# Altium schematic sheet AnalogADCs.SchDoc: ADC
size Letter; Engineer: Nathan Petersen; DocumentNumber: 12; Revision: v1.2; SheetNumber: 12; SheetTotal: 26
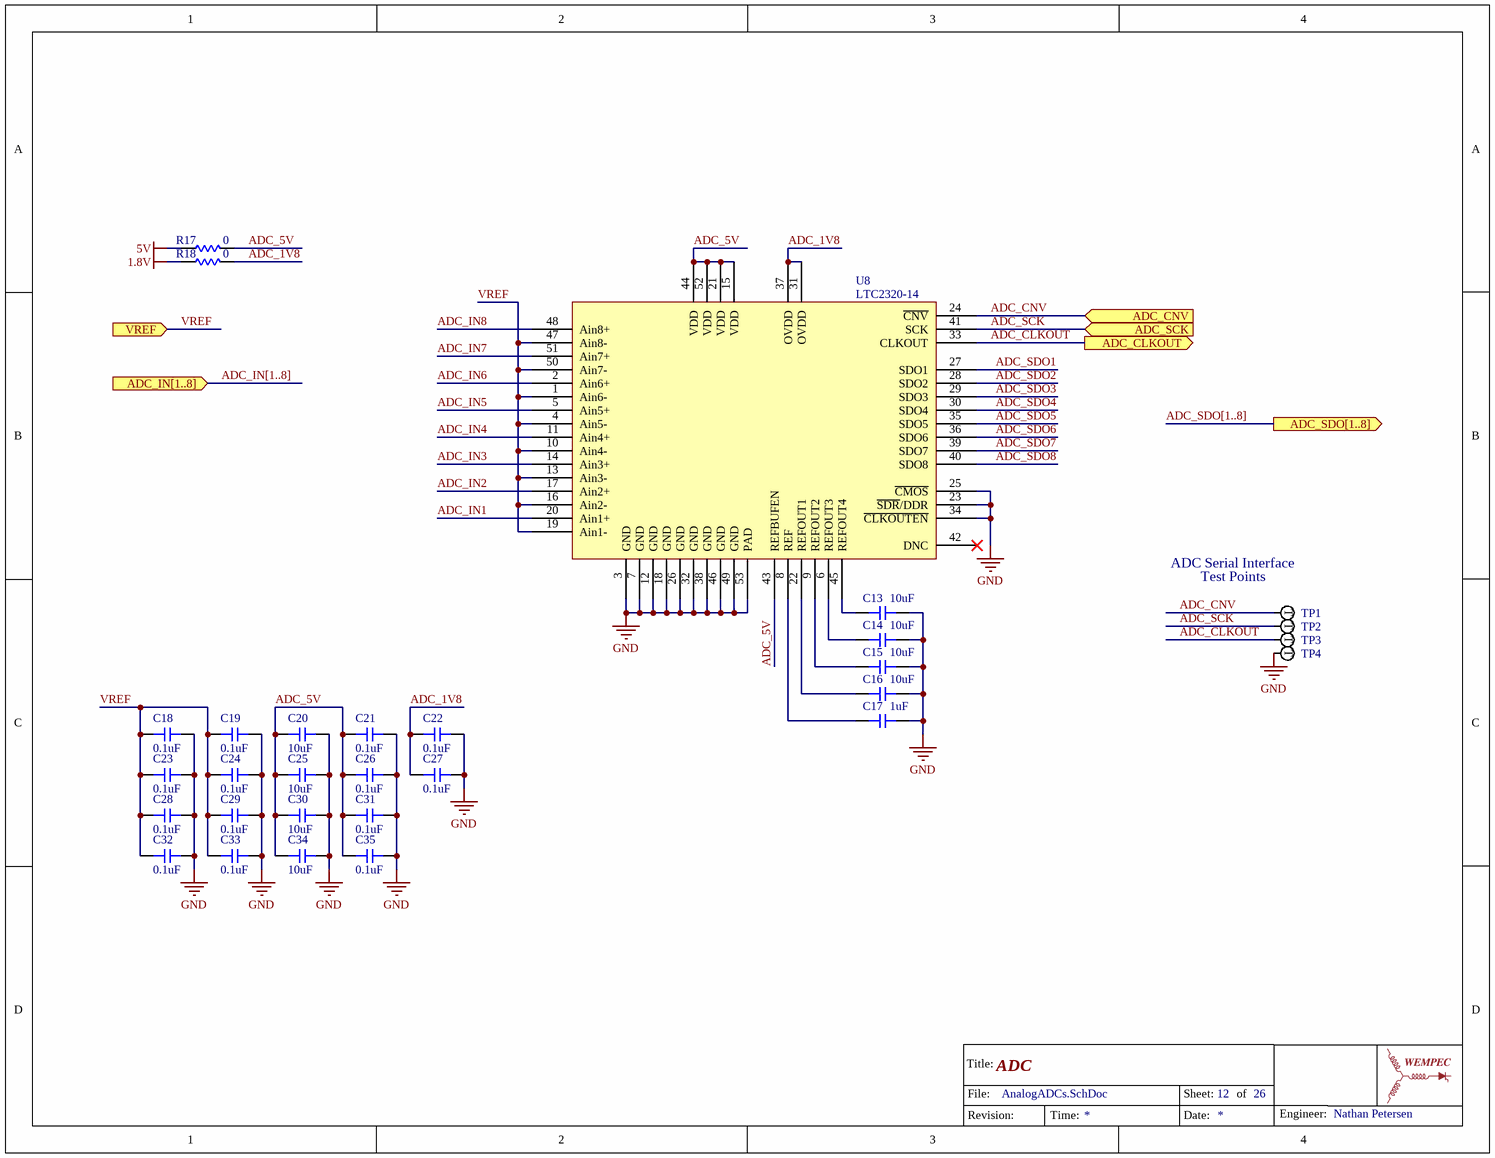
[diagram p0: AnalogADCs.SchDoc]

## Parts
C13  value 10uF  [0603-CAP]  (hidden comment: Capacitor)
C14  value 10uF  [0603-CAP]  (hidden comment: Capacitor)
C15  value 10uF  [0603-CAP]  (hidden comment: Capacitor)
C16  value 10uF  [0603-CAP]  (hidden comment: Capacitor)
C17  value 1uF  [0603-CAP]  (hidden comment: Capacitor)
C18  value 0.1uF  [0603-CAP]  (hidden comment: Capacitor)
C19  value 0.1uF  [0603-CAP]  (hidden comment: Capacitor)
C20  value 10uF  [0603-CAP]  (hidden comment: Capacitor)
C21  value 0.1uF  [0603-CAP]  (hidden comment: Capacitor)
C22  value 0.1uF  [0603-CAP]  (hidden comment: Capacitor)
C23  value 0.1uF  [0603-CAP]  (hidden comment: Capacitor)
C24  value 0.1uF  [0603-CAP]  (hidden comment: Capacitor)
C25  value 10uF  [0603-CAP]  (hidden comment: Capacitor)
C26  value 0.1uF  [0603-CAP]  (hidden comment: Capacitor)
C27  value 0.1uF  [0603-CAP]  (hidden comment: Capacitor)
C28  value 0.1uF  [0603-CAP]  (hidden comment: Capacitor)
C29  value 0.1uF  [0603-CAP]  (hidden comment: Capacitor)
C30  value 10uF  [0603-CAP]  (hidden comment: Capacitor)
C31  value 0.1uF  [0603-CAP]  (hidden comment: Capacitor)
C32  value 0.1uF  [0603-CAP]  (hidden comment: Capacitor)
C33  value 0.1uF  [0603-CAP]  (hidden comment: Capacitor)
C34  value 10uF  [0603-CAP]  (hidden comment: Capacitor)
C35  value 0.1uF  [0603-CAP]  (hidden comment: Capacitor)
R17  value 0  [1206-RES]  (hidden comment: Resistor)
R18  value 0  [1206-RES]  (hidden comment: Resistor)
TP1  Test Point  [RCU-0C]  (value not drawn)
TP2  Test Point  [RCU-0C]  (value not drawn)
TP3  Test Point  [RCU-0C]  (value not drawn)
TP4  Test Point  [RCU-0C]  (value not drawn)
U8  LTC2320-14  [QFN50P700X800X80_HS-53N]

## Ports
ADC_CLKOUT (out), ADC_CNV (in), ADC_IN[1..8] (in), ADC_SCK (in), ADC_SDO[1..8] (out), VREF (in)

## Nets
1.8V: R18.1
5V: R17.1
GND: C13.2 C14.2 C15.2 C16.2 C17.2 C18.2 C19.2 C20.2 C21.2 C22.2 C23.2 C24.2 C25.2 C26.2 C27.2 C28.2 C29.2 C30.2 C31.2 C32.2 C33.2 C34.2 C35.2 TP4.1 U8.3(GND) U8.7(GND) U8.12(GND) U8.18(GND) U8.23(~{SDR}/DDR) U8.25(~{CMOS}) U8.26(GND) U8.32(GND) U8.34(~{CLKOUTEN}) U8.38(GND) U8.46(GND) U8.49(GND) U8.53(PAD)
ADC_1V8: C22.1 C27.1 R18.2 U8.31(OVDD) U8.37(OVDD)
ADC_5V: C20.1 C21.1 C25.1 C26.1 C30.1 C31.1 C34.1 C35.1 R17.2 U8.15(VDD) U8.21(VDD) U8.43(REFBUFEN) U8.44(VDD) U8.52(VDD)
ADC_CLKOUT: TP3.1 U8.33(CLKOUT) ; port ADC_CLKOUT
ADC_CNV: TP1.1 U8.24(~{CNV}) ; port ADC_CNV
ADC_IN1: U8.20(Ain1+)
ADC_IN2: U8.17(Ain2+)
ADC_IN3: U8.14(Ain3+)
ADC_IN4: U8.11(Ain4+)
ADC_IN5: U8.5(Ain5+)
ADC_IN6: U8.2(Ain6+)
ADC_IN7: U8.51(Ain7+)
ADC_IN8: U8.48(Ain8+)
ADC_SCK: TP2.1 U8.41(SCK) ; port ADC_SCK
ADC_SDO1: U8.27(SDO1)
ADC_SDO2: U8.28(SDO2)
ADC_SDO3: U8.29(SDO3)
ADC_SDO4: U8.30(SDO4)
ADC_SDO5: U8.35(SDO5)
ADC_SDO6: U8.36(SDO6)
ADC_SDO7: U8.39(SDO7)
ADC_SDO8: U8.40(SDO8)
VREF: C18.1 C19.1 C23.1 C24.1 C28.1 C29.1 C32.1 C33.1 U8.1(Ain6-) U8.4(Ain5-) U8.10(Ain4-) U8.13(Ain3-) U8.16(Ain2-) U8.19(Ain1-) U8.47(Ain8-) U8.50(Ain7-) ; port VREF
NetC13_1: C13.1 U8.45(REFOUT4)
NetC14_1: C14.1 U8.6(REFOUT3)
NetC15_1: C15.1 U8.9(REFOUT2)
NetC16_1: C16.1 U8.22(REFOUT1)
NetC17_1: C17.1 U8.8(REF)

Not connected (* = marked no-connect by the designer): U8 42(DNC)*

## Buses and harness runs
bus ADC_IN[1..8] = port ADC_IN[1..8]
bus ADC_SDO[1..8] = port ADC_SDO[1..8]

## Notes on the sheet
- ADC Serial Interface
- Test Points
- Title:
- File:
- Sheet:
- of
- Revision:
- Time:
- Date:
- Engineer:
- (in symbol Test Point) T

## Library data of the parts
U8 = LTC2320-14: IC ADC 14BIT 1.5MSPS SAR 52QFN - 14 Bit Analog to Digital Converter 8 Input 4 SAR 52-QFN (7x8); Supplier 1: Digi-Key; Supplier Part Number 1: LTC2320CUKG-14#PBF-ND
C13-C35 = Capacitor: Supplier 1: Digi-Key
  C13: Supplier Part Number 1: 1276-1192-1-ND
  C14-C16 C20 C25 C30 C34: Supplier Part Number 1: 1276-1119-1-ND
  C17: Supplier Part Number 1: 1276-6524-1-ND
  C18 C19 C21-C24 C26-C29 C31-C33 C35: Supplier Part Number 1: 1276-1012-1-ND
R17 R18 = Resistor: Supplier 1: Digi-Key; Supplier Part Number 1: 311-0.0ERCT-ND
TP1-TP4 = Test Point: Footprint: *; Supplier 1: Digi-Key; Supplier Part Number 1: A106145CT-ND